# EasyEDA Pro project psu-5v-v101.eprj, board main-board
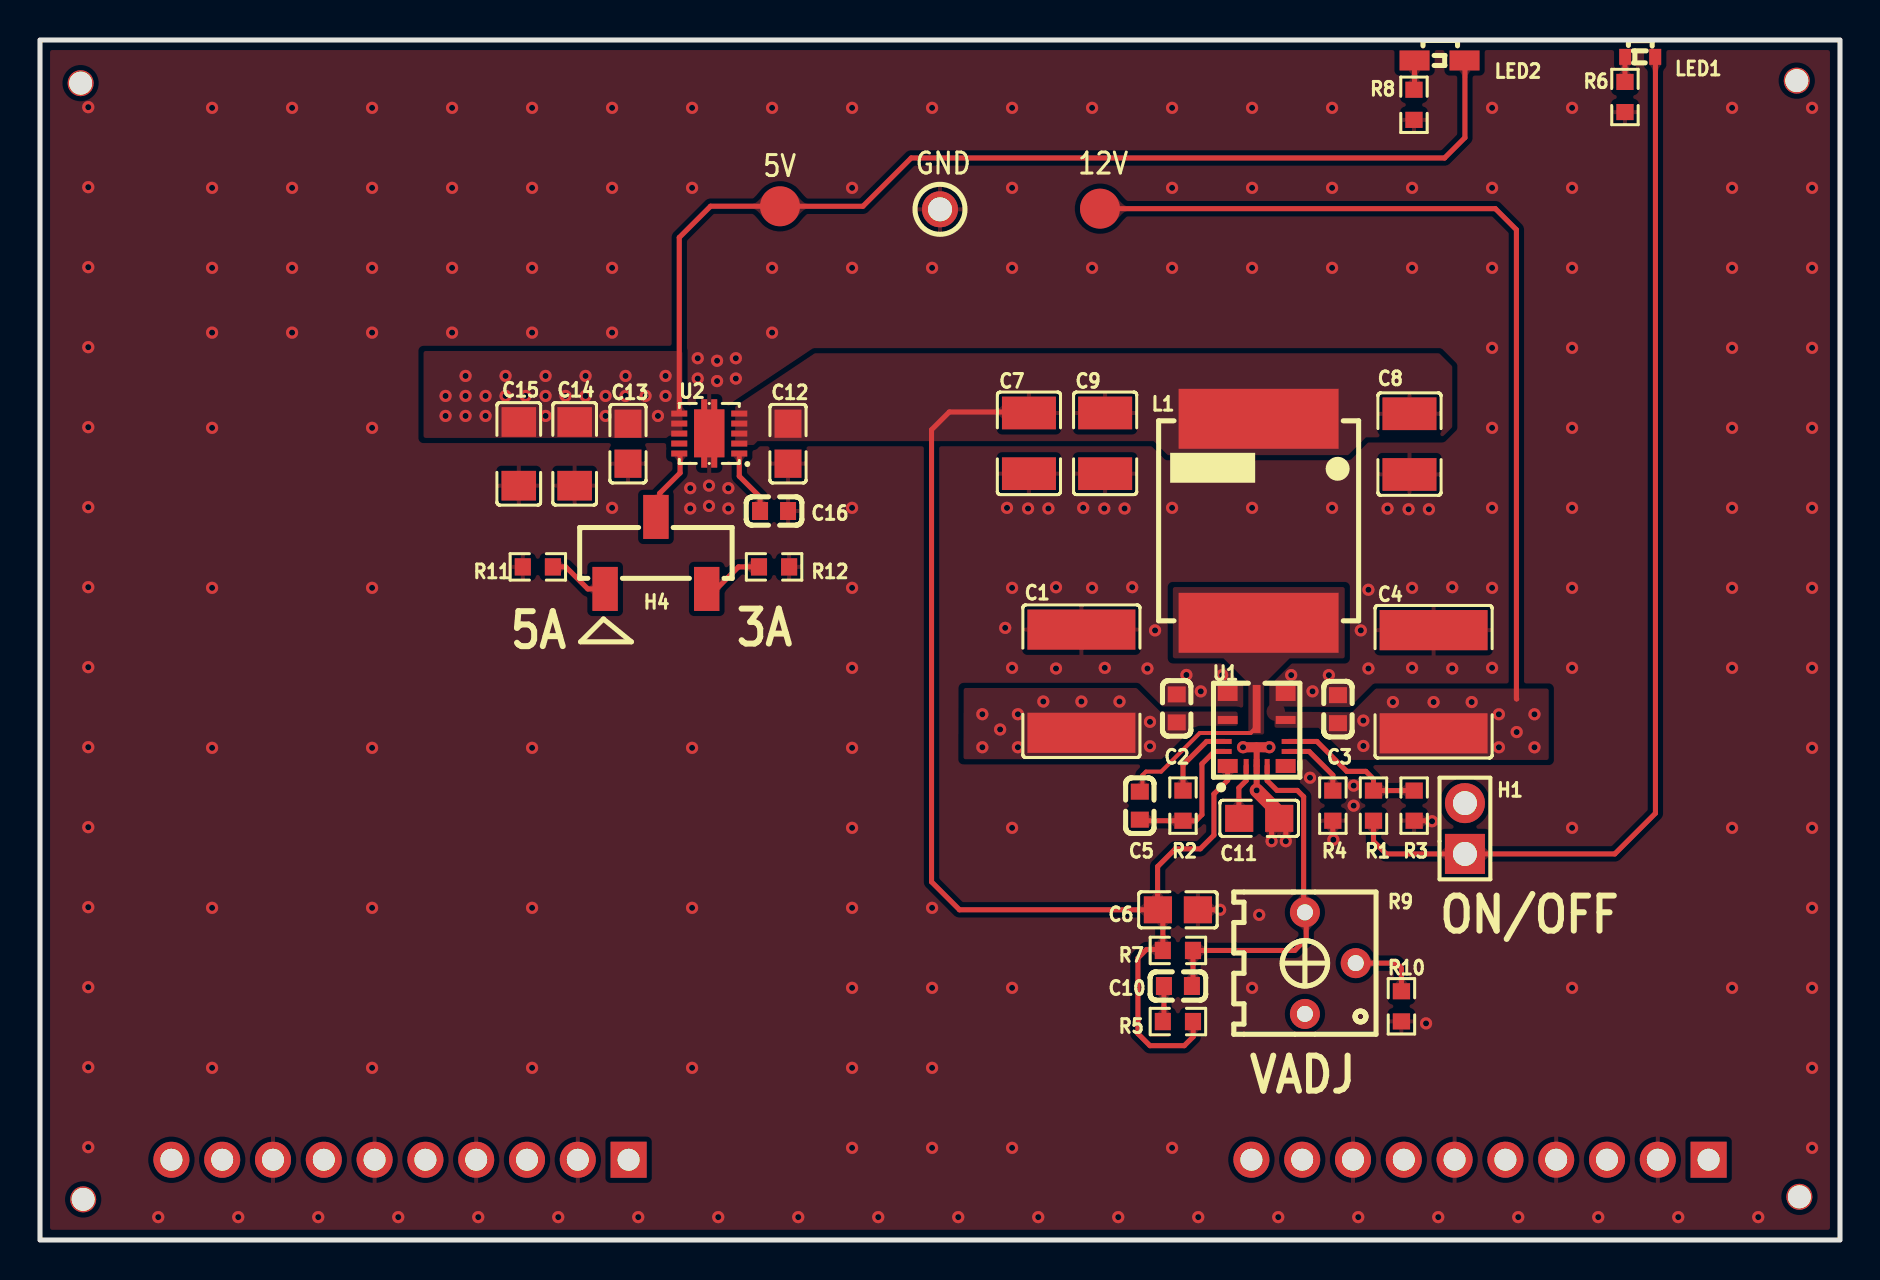
[diagram p7: board, top side]
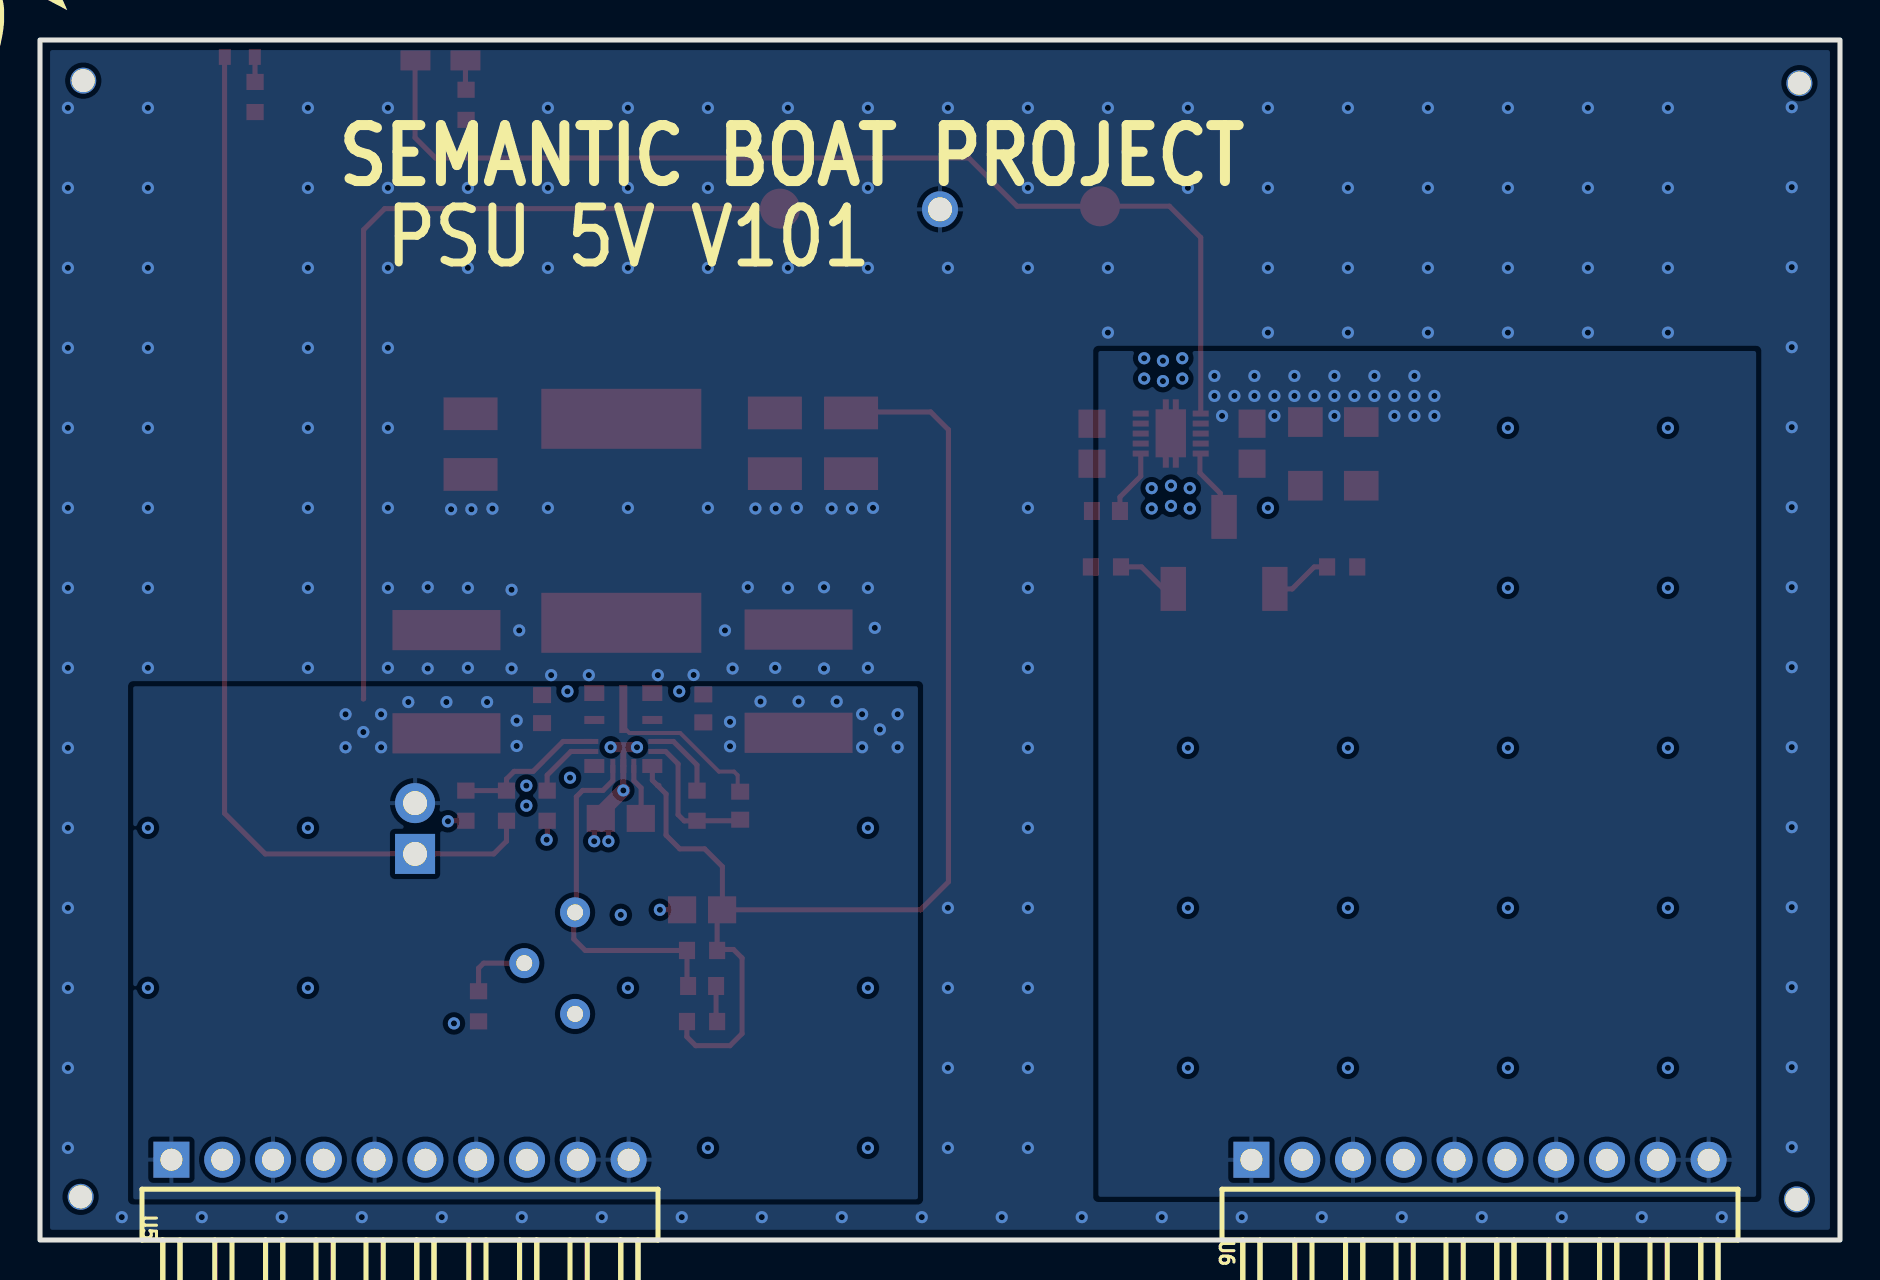
[diagram p8: board, bottom side, seen from below]

Outline 90 x 60 mm; copper layers: Top Layer, Inner1, Inner2, Bottom Layer. Coordinates in mm from the lower left corner of the outline.
Outline path: rectangle 0,60 90,0
Stack: Top Layer 0.035mm Outer layer thickness 1oz / Dielectric1 0.2104mm 7628 RC49% 8.6mil / Inner1 0.0152mm Inner layer thickness / Dielectric2 1.065mm 1.1mm H/HOZ Copper / Inner2 0.0152mm Inner layer thickness / Dielectric3 0.2104mm 7628 RC49% 8.6mil / Bottom Layer 0.035mm Outer layer thickness 1oz

## Design rules (mm)
template: JLCPCB Capability(Two Layers Board)
spacing copperThickness1oz (default): track to track 0.102, other pairs 0.152 to 0.3
spacing copperThickness2oz: track to track 0.203, other pairs 0.152 to 0.3
track width copperThickness1oz (default): min 0.127, default 0.254, max 2.54
track width copperThickness2oz: min 0.203, default 0.254, max 2.54
differential pair differentialPair (default): width min 0.127, default 0.254, max 2.54; gap min 0.152, default 0.152
via viaSize (default): diameter min 0.5, default 0.61, max 10; hole min 0.3, default 0.305, max 6.3

## Placement (name value [footprint] x y rotation side)
C1  22uF  [C2220]  52.07 27.94 270 top
C2  100nF  [C0603]  56.83 26.58 270 top
C3  100nF  [C0603]  64.9 26.54 270 top
C4  22uF  [C2220]  69.68 27.91 270 top
C5  100nF  [C0603]  54.99 21.72 90 top
C6  1uF  [C0805]  56.9 16.51 0 top
C7  47uF  [C1210]  49.45 39.83 90 top
C8  47uF  [C1210]  68.47 39.8 90 top
C9  47uF  [C1210]  53.26 39.83 90 top
C10  22pF  [C0603]  56.9 12.7 0 top
C11  1uF  [C0805]  60.96 21.08 180 top
C12  1uF  [C0805]  37.4 39.81 270 top
C13  1uF  [C0805]  29.4 39.81 270 top
C14  22uF  [C1206]  26.73 39.31 90 top
C15  22uF  [C1206]  23.94 39.31 90 top
C16  3.3nF  [C0603]  36.7 36.45 180 top
H1  PZ254V-11-02P  [HDR-TH_2P-P2.54-V-M]  71.25 20.57 90 top
H4  X6511WVS-03H-C60D48R2  [HDR-SMD_3P-P2.54_XKB_X6511WVS-03H-C60D48R2]  30.8 34.35 0 top
L1  4.7uH  [IND-SMD_L10.9-W10.0]  60.93 35.96 90 top
LED1  XL-1606UYC  [LED-SMD_L1.7-W1.1-RD_27-21]  80.01 59.16 0 top
LED2  LTST-S220TGKT  [LED-SMD_L2.2-W0.6-RD_GREEN]  69.98 58.98 0 top
NOREF  -  [Pad_e61]  2.03 57.84 270 top
NOREF#2  -  [Pad_e58]  2.16 2.03 0 top
NOREF#3  -  [Pad_e59]  87.97 2.16 90 top
NOREF#4  -  [Pad_e60]  87.84 57.97 180 top
R1  10kΩ  [R0603]  66.68 21.72 90 top
R2  0Ω  [R0603]  57.15 21.72 90 top
R3  100kΩ  [R0603]  68.71 21.72 90 top
R4  33kΩ  [R0603]  64.64 21.72 90 top
R5  1kΩ  [R0603]  56.9 10.92 0 top
R6  3.3kΩ  [R0603]  79.25 57.15 270 top
R7  100kΩ  [R0603]  56.9 14.48 180 top
R8  1kΩ  [R0603]  68.7 56.76 270 top
R9  5kΩ  [RES-ADJ-TH_3P-L6.6-W7.0-P2.54-L_3362P]  64.52 13.84 270 top
R10  22kΩ  [R0603]  68.07 11.68 90 top
R11  22kΩ  [R0603]  24.89 33.66 0 top
R12  36kΩ  [R0603]  36.7 33.66 180 top
TP8  RH-5004  [TESTPOINT_TH_BD2.5-D1.2]  45 51.53 0 top
TP38  -  [Test-Point-0.5mm]  53 51.57 0 top
TP39  -  [Test-Point-0.5mm]  37 51.69 0 top
U1  LM61460AANRJRR  [VQFN-HR-14_L4.0-W3.5-P0.50-TL_TI_RJR-1]  60.83 25.53 90 top
U2  TCKE812NA,RF  [VSON-10_L3.0-W3.0-P0.50-TL-EP]  33.46 40.32 180 top
U5  2541WR-10P  [HDR-TH_10P-P2.54-H-M-W10.4]  72 4.01 180 bottom
U6  2541WR-10P  [HDR-TH_10P-P2.54-H-M-W10.4]  18 4.01 180 bottom

## Footprints (pads in the part's own frame, mm; a bottom-side part is the same pattern mirrored in y, then rotated)
C0603
  rect 0.8x0.9 smd: 1(-0.7,0) 2(0.7,0)
C0805
  rect 1.41x1.35 smd: 1(-1,0) 2(1,0)
C1206
  rect 1.485x1.728 smd: 1(-1.593,0) 2(1.593,0)
C1210
  rect 1.635x2.7 smd: 1(-1.518,0) 2(1.518,0)
C2220
  rect 2.01x5.4 smd: 1(-2.58,0) 2(2.58,0)
HDR-SMD_3P-P2.54_XKB_X6511WVS-03H-C60D48R2
  rect 1.27x2.2 smd: 1(-2.54,-1.8) 2(0,1.8) 3(2.54,-1.8)
HDR-TH_2P-P2.54-V-M
  rect 2x2 hole 1.2: 1(-1.27,0)
  round 2 hole 1.2: 2(1.27,0)
HDR-TH_10P-P2.54-H-M-W10.4
  rect 1.8x1.8 hole 1.1: 1(-11.43,0)
  round 1.8 hole 1.1: 2(-8.89,0) 3(-6.35,0) 4(-3.81,0) 5(-1.27,0) 6(1.27,0) 7(3.81,0) 8(6.35,0) 9(8.89,0) 10(11.43,0)
IND-SMD_L10.9-W10.0
  rect 3x8 smd: 1(-5.1,0) 2(5.1,0)
LED-SMD_L1.7-W1.1-RD_27-21
  rect 0.6x0.8 smd: 1(-0.75,0) 2(0.75,0)
LED-SMD_L2.2-W0.6-RD_GREEN
  rect 1.5x1 smd: 1(-1.25,0) 2(1.25,0)
Pad_e58
  round 1.3 hole 1.152: 1(0,0)
Pad_e59
  round 1.3 hole 1.152: 1(0,0)
Pad_e60
  round 1.3 hole 1.152: 1(0,0)
Pad_e61
  round 1.3 hole 1.152: 1(0,0)
R0603
  rect 0.806x0.864 smd: 1(-0.753,0) 2(0.753,0)
RES-ADJ-TH_3P-L6.6-W7.0-P2.54-L_3362P
  round 1.5 hole 0.8: 1(-2.54,-1.27) 2(0,1.27) 3(2.54,-1.27)
Test-Point-0.5mm
  round 2 smd: 1(0,0)
TESTPOINT_TH_BD2.5-D1.2
  round 1.8 hole 1.2: 1(0,0)
VQFN-HR-14_L4.0-W3.5-P0.50-TL_TI_RJR-1
  rect 0.7x1 smd: 1(-1.825,1.45) 5(-1.825,-1.45)
  rect 0.7x0.25 smd: 2(-1.825,0.525) 4(-1.825,-0.525)
  rect 0.7x0.3 smd: 3(-1.825,0)
  rect 0.25x0.7 smd: 6(-1.1,-1.6) 7(-0.6,-1.6) 13(-0.6,1.6) 14(-1.1,1.6)
  rect 0.4x1 smd: 8(0.475,-1.45) 12(0.475,1.45)
  rect 0.8x1 smd: 9(1.825,-1.45) 11(1.825,1.45)
  rect 2.4x0.4 smd: 10(1.025,0)
VSON-10_L3.0-W3.0-P0.50-TL-EP
  rect 0.8x0.3 smd: 1(-1.5,1) 2(-1.5,0.5) 3(-1.5,0) 4(-1.5,-0.5) 5(-1.5,-1) 6(1.5,-1) 7(1.5,-0.5) 8(1.5,0) 9(1.5,0.5) 10(1.5,1)
  custom 1.52x3.42 smd: 11(0.002,-0.009)

## Nets
As in the schematic.

Pads without a net: NOREF 1; NOREF#2 1; NOREF#3 1; NOREF#4 1; R9 3; U1 5; U2 9

## Via types
v1: diameter 0.61, hole 0.305, Top Layer to Bottom Layer, 266 vias

## Routing (per net, layer and track width the routed paths; a pad name or vN(x,y) marks a point on that pad's centre or on a via; arc(x,y) is an arc through that point)
5V_UNFUSED: length 60.5
  Top Layer w0.254: R5.2 57.66,10.91 57.66,10.16 57.21,9.72 55.5,9.72 54.9,10.32 54.9,14.1 55.32,14.53 56.09,14.53 R7.2 56.14,16.26 C6.1 ; C6.1 45.97,16.51 44.58,17.91 44.58,40.51 45.47,41.4 49.4,41.4 C7.2 ; C6.1 55.88,16.53 55.88,18.67 56.77,19.56 58.01,19.56 58.7,20.24 58.7,22.3 59.13,22.73 ; 59.06,22.73 59.13,22.73 ; 59.13,22.73 59.38,22.99 U1.1
+5V: length 54
  Top Layer w0.254: U2.6 31.96,50.12 33.53,51.69 37,51.69 TP39.1 41.15,51.69 43.56,54.1 70.23,54.1 71.25,55.12 71.25,58.96 LED2.2
  vias: v1(20.28,42.2) v1(20.28,41.2) v1(21.28,43.2) v1(21.28,42.2) v1(21.28,41.2) v1(22.28,42.2) v1(22.28,41.2) v1(23.28,43.2) v1(23.28,42.2) v1(24.28,42.2) v1(25.28,43.2) v1(25.28,42.2) v1(25.28,41.2) v1(26.28,42.2) v1(27.28,43.2) v1(27.28,42.2) v1(28.28,42.2) v1(28.28,41.2) v1(29.28,43.2) v1(29.28,42.2) v1(30.28,42.2) v1(30.9,41.2) v1(31.28,43.2) v1(31.28,42.2)
+12V: length 44.7
  Top Layer w0.254: TP38.1 72.77,51.57 73.82,50.51 73.82,27.06 73.83,27.05
  vias: v1(47.12,26.29) v1(47.12,24.64) v1(48.01,25.53) v1(48.9,26.29) v1(48.9,24.64) v1(50.16,26.92) v1(52.07,26.92) v1(53.97,26.92) v1(55.5,25.91) v1(55.5,24.69) v1(66.17,25.97) v1(66.17,24.7) v1(67.65,26.9) v1(69.68,26.9) v1(71.58,26.9) v1(72.94,26.29) v1(72.94,24.64) v1(73.83,25.4) v1(74.72,26.29) v1(74.72,24.64)
GND: length 10.8
  Top Layer w0.254: v1(61.58,19.94) 61.58,20.7 C11.1 62.29,20.75 v1(62.29,19.94) ; 64.68,20.01 64.64,20.05 64.64,20.93 ; v1(59.01,16.51) C6.2 ; 68.72,20.96 69.56,20.96 69.57,20.97
  Top Layer w0.3: 60.82,24.64 60.83,24.63 U1.3 v1(60.83,22.48)
  Top Layer w0.5: v1(61.47,24.64) v1(60.15,24.64)
  Top Layer w0.7: C11.1 61.96,21.35 v1(60.83,22.48)
  vias: v1(2.41,56.64) v1(2.41,52.64) v1(2.41,48.64) v1(2.41,44.64) v1(2.41,40.64) v1(2.41,36.64) v1(2.41,32.64) v1(2.41,28.64) v1(2.41,24.64) v1(2.41,20.64) v1(2.41,16.64) v1(2.41,12.64) v1(2.41,8.64) v1(2.41,4.64) v1(5.91,1.14) v1(8.6,56.61) v1(8.6,52.61) v1(8.6,48.61) v1(8.6,45.37) v1(8.6,40.61) v1(8.6,32.61) v1(8.6,24.61) v1(8.6,16.61) v1(8.6,8.61) v1(9.91,1.14) v1(12.6,56.61) v1(12.6,52.61) v1(12.6,48.61) v1(12.6,45.37) v1(13.91,1.14) v1(16.6,56.61) v1(16.6,52.61) v1(16.6,48.61) v1(16.6,45.37) v1(16.6,40.61) v1(16.6,32.61) v1(16.6,24.61) v1(16.6,16.61) v1(16.6,8.61) v1(17.91,1.14) v1(20.6,56.61) v1(20.6,52.61) v1(20.6,48.61) v1(20.6,45.37) v1(21.91,1.14) v1(24.6,56.61) v1(24.6,52.61) v1(24.6,48.61) v1(24.6,45.37) v1(24.6,24.61) v1(24.6,16.61) v1(24.6,8.61) v1(25.91,1.14) v1(28.6,56.61) v1(28.6,52.61) v1(28.6,48.61) v1(28.6,45.37) v1(28.6,36.61) v1(29.91,1.14) v1(32.51,37.59) v1(32.51,36.58) v1(32.6,56.61) v1(32.6,52.61) v1(32.6,24.61) v1(32.6,16.61) v1(32.6,8.61) v1(32.89,44.09) v1(32.89,43.07) v1(33.45,37.72) v1(33.45,36.7) v1(33.85,43.96) v1(33.85,42.95) v1(33.91,1.14) v1(34.42,37.59) v1(34.42,36.58) v1(34.79,44.09) v1(34.79,43.07) v1(36.6,56.61) v1(36.6,48.61) v1(36.6,45.37) v1(37.91,1.14) v1(40.6,56.61) v1(40.6,52.61) v1(40.6,48.61) v1(40.6,36.61) v1(40.6,32.61) v1(40.6,28.61) v1(40.6,24.61) v1(40.6,20.61) v1(40.6,16.61) v1(40.6,12.61) v1(40.6,8.61) v1(40.6,4.61) v1(41.91,1.14) v1(44.6,56.61) v1(44.6,48.61) v1(44.6,16.61) v1(44.6,12.61) v1(44.6,8.61) v1(44.6,4.61) v1(45.91,1.14) v1(48.35,36.61) v1(48.26,30.61) v1(48.6,56.61) v1(48.6,52.61) v1(48.6,48.61) v1(48.6,32.61) v1(48.6,28.61) v1(48.6,20.61) v1(48.6,12.61) v1(48.6,4.61) v1(49.4,36.58) v1(49.91,1.14) v1(50.42,36.58) v1(50.8,32.64) v1(50.8,28.58) v1(52.16,36.61) v1(52.6,56.61) v1(52.6,48.61) v1(52.6,32.61) v1(53.21,36.58) v1(53.24,28.61) v1(53.91,1.14) v1(54.23,36.58) v1(54.61,32.64) v1(55.37,28.58) v1(55.75,30.48) v1(56.6,56.61) v1(56.6,52.61) v1(56.6,48.61) v1(56.6,36.61) v1(56.6,4.61) v1(57.32,28.25) v1(57.91,1.14) v1(58.04,27.43) v1(59.11,28.24) v1(60.6,56.61) v1(60.6,52.61) v1(60.6,48.61) v1(60.6,36.61) v1(60.6,12.61) v1(60.96,16.26) v1(61.91,1.14) v1(62.56,28.24) v1(63.5,23.11) v1(63.63,27.43) v1(64.44,28.24) v1(64.6,56.61) v1(64.6,52.61) v1(64.6,48.61) v1(64.6,36.61) v1(64.67,20.01) v1(65.68,22.72) v1(65.68,21.72) v1(65.91,1.14) v1(66.04,30.48) v1(66.42,32.51) v1(66.42,28.58) v1(67.38,36.57) v1(68.43,36.54) v1(68.6,52.61) v1(68.6,48.61) v1(68.6,32.61) v1(68.6,28.61) v1(69.3,10.83) v1(69.45,36.54) v1(69.6,20.94) v1(69.91,1.14) v1(70.61,32.64) v1(70.61,28.58) v1(72.6,56.61) v1(72.6,52.61) v1(72.6,48.61) v1(72.6,44.61) v1(72.6,40.61) v1(72.6,36.61) v1(72.6,32.61) v1(72.6,28.61) v1(73.91,1.14) v1(76.6,56.61) v1(76.6,52.61) v1(76.6,48.61) v1(76.6,44.61) v1(76.6,40.61) v1(76.6,36.61) v1(76.6,32.61) v1(76.6,28.61) v1(76.6,20.61) v1(76.6,12.61) v1(77.91,1.14) v1(81.91,1.14) v1(84.6,56.61) v1(84.6,52.61) v1(84.6,48.61) v1(84.6,44.61) v1(84.6,40.61) v1(84.6,36.61) v1(84.6,32.61) v1(84.6,28.61) v1(84.6,20.61) v1(84.6,12.61) v1(85.91,1.14) v1(88.6,56.61) v1(88.6,52.61) v1(88.6,48.61) v1(88.6,44.61) v1(88.6,40.61) v1(88.6,36.61) v1(88.6,32.61) v1(88.6,28.61) v1(88.6,24.61) v1(88.6,20.61) v1(88.6,16.61) v1(88.6,12.61) v1(88.6,8.61) v1(88.6,4.61)
$1N1787: length 7.2
  Top Layer w0.254: U1.7 63.85,24.93 65.34,23.43 66.29,23.43 66.68,23.05 66.68,22.86 ; R1.2 R3.2
$1N1788: length 3.5
  Top Layer w0.254: U1.6 63.46,24.43 64.64,23.24 R4.2
$1N1790: length 2.8
  Top Layer w0.254: U1.2 60.31,22.97 59.94,22.61 59.94,21.1 C11.2
$1N1799: length 7.2
  Top Layer w0.254: C5.1 55.04,20.96 R2.1 57.16,20.95 57.78,20.95 58.1,21.27 58.1,23.81 58.72,24.43 U1.14
$1N1800: length 8.5
  Top Layer w0.2: C5.2 55.12,22.54 55.12,23.24 55.3,23.42 56.06,23.42 57.99,25.35 60.53,25.35 60.83,25.65 U1.10
$1N1801: length 3.8
  Top Layer w0.254: U1.13 58.33,24.93 57.15,23.75 R2.2
$1N1803: length 1.8
  Top Layer w0.254: R5.1 56.2,10.98 C10.1
$1N1805: length 17.8
  Top Layer w0.254: C10.2 57.65,12.75 R7.1 62.74,14.48 63.31,15.05 63.31,16.32 R9.1 63.18,16.45 63.18,22.16 62.87,22.48 61.85,22.48 61.36,22.97 U1.4
$1N1808: length 3.5
  Top Layer w0.254: R10.2 68.07,13.59 67.82,13.84 R9.2
$1N1828: length 3.3
  Top Layer w0.254: C16.2 36,37.15 34.96,38.19 U2.1
$1N1836: length 3.1
  Top Layer w0.254: H4.1 27.39,32.55 26.29,33.66 R11.2
$1N1838: length 3.1
  Top Layer w0.254: H4.3 33.82,32.55 34.93,33.66 R12.2
$1N1840: length 3.7
  Top Layer w0.254: U2.10 32,39.28 32,38.35 30.99,37.34 30.99,36.35 H4.2
$1N2829: length 1.3
  Top Layer w0.254: LED1.1 79.25,59.14 R6.1
$1N2839: length 54.1
  Top Layer w0.254: LED1.2 80.77,59.14 80.77,21.34 78.74,19.3 H1.1 67.31,19.3 66.68,19.94 R1.1
$1N2859: length 1.5
  Top Layer w0.254: R8.1 68.73,57.54 LED2.1

## Copper pours and planes (outline as drawn; the poured copper is in the pictures)
5V_UNFUSED on Top Layer: 34.76,40.98 34.76,39.76 35.69,39.75 35.88,39.94 55.69,39.94 56.39,39.24 65.41,39.24 66.3,40.14 70.11,40.14 70.61,40.64 70.61,43.69 69.96,44.34 38.74,44.34 34.76,41.68
+5V on Top Layer: 19.18,44.45 32.12,44.45 32.12,40.1 19.18,40.1
+5V on Bottom Layer: 4.19,44.45 37.08,44.45 37.08,2.16 4.19,2.16
+12V on Top Layer: 65.61,26.39 61.79,26.42 61.72,26.42 61.72,25.61 63.93,25.61 65.53,24 75.44,24 75.44,27.57 66.79,27.57
+12V on Top Layer: 56.01,26.42 59.79,26.42 59.88,26.41 59.89,25.64 59.88,25.63 57.68,25.63 56.08,24.04 46.18,24.04 46.18,27.6 54.83,27.6
+12V on Bottom Layer: 46.1,27.69 85.34,27.69 85.34,2.03 46.1,2.03
GND on Top Layer: -2.41,62.1 91.69,62.1 91.69,-1.52 -2.41,-1.52
GND on Bottom Layer: -2.79,62.61 91.31,62.61 91.31,-1.65 -2.79,-1.65
GND on Inner1: -2.54,61.85 92.07,61.85 92.07,-1.4 -2.54,-1.4
GND on Inner2: -2.54,62.61 91.95,62.61 91.95,-2.29 -2.54,-2.29
$1N1800 on Top Layer: 61.21,25.17 61.21,27.81 62.48,29.08 65.23,29.08 65.23,32.65 56.64,32.65 56.64,29.08 59.17,29.08 60.42,27.84 60.42,25.17

Small or netless copper shapes (teardrops, artwork), in the pictures only: 60 on Top Layer

## Text on the board
Bottom Silkscreen Layer: PSU 5V V101 | SEMANTIC BOAT PROJECT
Top Silkscreen Layer: 5V | GND | 12V | 5A | 3A | VADJ | ON/OFF
